# Altium schematic sheet SiPM_ASSY_3mm.SchDoc: MCORD AFE
size 420 x 297 mm; Author: G.Kasprowicz; CompanyName: WUT ISE; DrawnBy: G.Kasprowicz; Organization: WUT ISE; Address1: PW ISE; Address2: Nowowiejska 15/19 00-665 Warsaw; Address3: gkasprow@gmail.com; DocumentNumber: 1; Revision: 2; SheetNumber: 1; SheetTotal: 4; ModifiedBy: -; CheckedDate: -; Title2: top; DivGrp: WUT ISE; Designer: G.Kasprowicz; ModifiedDate: -; ProjectName: Sensor Box
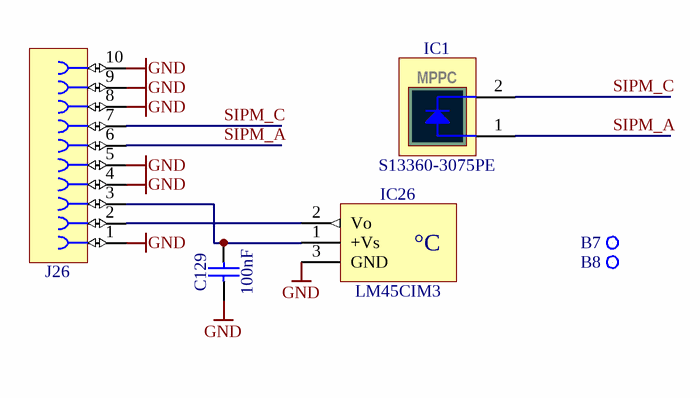
[diagram p0: SiPM_ASSY_3mm.SchDoc]

## Parts
B7  Plated Hole  [MTG270_500]  (value not drawn)  (no BOM)
B8  Plated Hole  [MTG270_500]  (value not drawn)  (no BOM)
C129  100nF  [CAPC1005X55N]
IC1  S13360-3075PE  [HAMAMATSU_S13360-3075PE]
IC26  LM45CIM3  [SOT95P251X112-3N]
J26  FFC/FPC  [MOLEX_52745-1097]  (value not drawn)

## Nets
GND: C129.1 IC26.3(GND) J26.1 J26.4 J26.5 J26.8 J26.9 J26.10
SIPM_A: IC1.1(A) J26.6
SIPM_C: IC1.2(C) J26.7
NetC129_2: C129.2 IC26.1(+Vs) J26.3
NetIC26_2: IC26.2(Vo) J26.2

Not connected (* = marked no-connect by the designer): B7 1; B8 1

## Notes on the sheet
- Project/Equipment
- Document
- Designer
- Drawn by
- Check.by
- Copyright WUT ISE 2018.
  This documentation describes Open Hardware and is licensed under the CERN OHL v.1.1. You may redistribute and modify this documentation under the terms of the CERN OHL v.1.1. (http://ohwr.org/CERNOHL). This documentation is distributed WITHOUT ANY EXPRESS OR IMPLIED WARRANTY, INCLUDING OF MERCHANTABILITY, SATISFACTORY QUALITY AND FITNESS FOR A PARTICULAR PURPOSE. Please see the CERN OHL v.1.1 for applicable conditions.
- Contact
- File
- Last Mod.
- Print Date
- Sheet
- Size
- A3
- of
- Rev
- (in symbol LM45CIM3) °C
- (in symbol SENS_S13360-3075PE) MPPC

## Library data of the parts
B7 B8 = PLATED_HOLE2.7_PAD5.0: Single Terminal Socket; Part Description: Plated Through Hole: Hole Dia.=2.7mm Pad Dia.=5.0mm; Mounted: No; Part Number: PLATED_HOLE2.7_PAD5.0; Component Type: Standard (No BOM); Pin Count: 1; Family: Plated Hole; Socket: No; SMD: No; Sense: No; Status: None; ComponentHeight: 0mm; HelpURL: Undefined; Author: CERN DEM JMW; CreateDate: 27.09.2011; LatestRevisionDate: 27.09.2011; PackageDescription: Plated Through Hole: Hole Dia.=2.7mm Pad Dia.=5.0mm
C129 = CC0402_100NF_16V_10%_X7R: Non-polarised capacitor; Part Description: SMD Multilayer Chip Ceramic Capacitor; Manufacturer: GENERIC; Manufacturer1 Part Number: GRM155R71C104KA88D; Voltage: 16V; TC: X7R; Tolerance: ±10%; Part Number: CC0402_100NF_16V_10%_X7R; Component Kind: Standard; Component Type: Standard; Pin Count: 2; Value: 100nF; Status: Not Recommended; Manufacturer Part Number: CC0402_100NF_16V_10%_X7R; Case: 0402; Mounted: Yes; Socket: No; SMD: Yes; Sense: No; HelpURL: \\cern.ch\dfs\Applications\Altium\Datasheets\CC0402_X7R_MURATA_GRM.pdf; Author: CERN DEM JLC; CreateDate: 05.12.2013; LatestRevisionDate: 03.12.2007; Manufacturer1 Example: MURATA; Manufacturer1 ComponentHeight: 0.55mm
IC1 = SENS_S13360-3075PE: MPPC (Multi-Pixel Photon Counter); Part Description: 3 x 3mm2, 75µm Pixel Pitch, SMD MPPC (Multi-Pixel Photon Counter); Manufacturer: HAMAMATSU; PressFit: No; Bonding: No; Part Number: S13360-3075PE; Component Kind: Standard; Component Type: Standard; Device: S13360-3075PE; PackageDescription: 3 x 3mm, 75µm Pixel Pitch, SMD MPPC (Multi-Pixel Photon Counter, Body 4.35mm x 3.85mm x 1.45mm; Manufacturer Part Number: S13360-3075PE; Pin Count: 2; Mounted: Yes; Socket: No; SMD: Yes; Sense: No; ComponentHeight: 1mm; HelpURL: \\cern.ch\dfs\Applications\Altium\Datasheets\S13081-050PE.pdf; Author: GK; CreateDate: 01.04.2015; LatestRevisionDate: 01.04.2015
IC26 = LM45CIM3: -20° to +100°C ±3°C Precision Centigrade Temperature Sensors; Manufacturer: NATIONAL SEMICONDUCTOR; PressFit: No; Bonding: No; Part Number: LM45CIM3; Component Kind: Standard; Component Type: Standard; Device: LM45CIM3; PackageDescription: SOT23 3-Leads, Pitch 0.95mm - Body 1.3x2.9mm, IPC Medium Density; Status: Obsolete; Part Description: -20° to +100°C ±3°C Precision Centigrade Temperature Sensors; Manufacturer Part Number: LM45CIM3; Pin Count: 3; Case: SOT23; Mounted: Yes; Socket: No; SMD: Yes; Sense: No; ComponentHeight: 1.12mm; HelpURL: \\cern.ch\dfs\Applications\Altium\Datasheets\LM45CIM3.pdf; Author: CERN DEM JLC; CreateDate: 02.12.2009; LatestRevisionDate: 02.12.2009
J26 = MOLEX_52745-1097: Connector 10 Female; Part Description: 10 Contacts, 0.5mm Pitch, Right Angled Surface Mount FFC/FPC Connector, ZIF, Top Contact Style; Manufacturer: MOLEX; PressFit: No; Part Number: MOLEX_52745-1097; Component Kind: Standard; Component Type: Standard; Pin Count: 10; Family: FFC/FPC; Mounted: Yes; Socket: No; SMD: Yes; Sense: No; Status: None; Manufacturer Part Number: 52745-1097; ComponentHeight: 2mm; HelpURL: \\cern.ch\dfs\Applications\Altium\Datasheets\MOLEX_52745-1097.pdf; Author: CERN DEM JLC; CreateDate: 04.11.2014; LatestRevisionDate: 05.12.2014